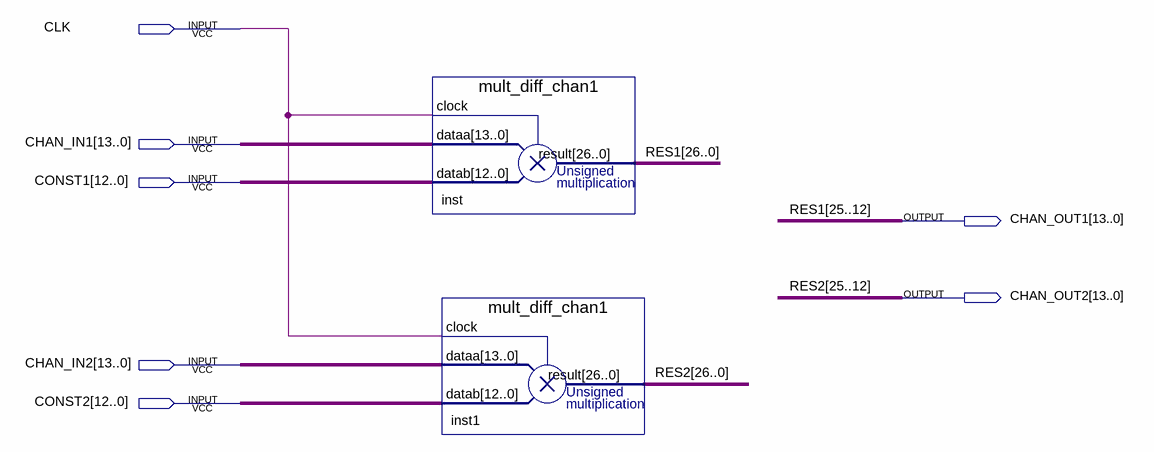
[diagram p0: schematic sheet]
// Quartus schematic mult_diff_chan.bdf as structural Verilog: 2 symbols, 7 pins
module mult_diff_chan (
  input  CLK,
  input  [13:0] CHAN_IN1,
  input  [12:0] CONST1,
  input  [13:0] CHAN_IN2,
  input  [12:0] CONST2,
  output [13:0] CHAN_OUT1,
  output [13:0] CHAN_OUT2
);

  wire [26:0] RES1, RES2;

  mult_diff_chan1 inst (.clock(CLK), .dataa(CHAN_IN1), .datab(CONST1), .result({RES1[26], CHAN_OUT1, RES1[11:0]}));
  mult_diff_chan1 inst1 (.clock(CLK), .dataa(CHAN_IN2), .datab(CONST2), .result({RES2[26], CHAN_OUT2, RES2[11:0]}));

  // Other names for the same wires on the sheet: RES1[25:12] = CHAN_OUT1; RES2[25:12] = CHAN_OUT2
endmodule
